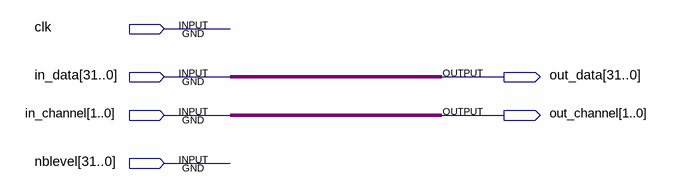
[diagram p0: schematic sheet]
// Quartus schematic nb_4ch.bdf as structural Verilog: 0 symbols, 6 pins
module nb_4ch (
  input  clk,
  input  [31:0] in_data,
  input  [1:0] in_channel,
  input  [31:0] nblevel,
  output [31:0] out_data,
  output [1:0] out_channel
);


  assign out_channel = in_channel;
  assign out_data = in_data;
endmodule
